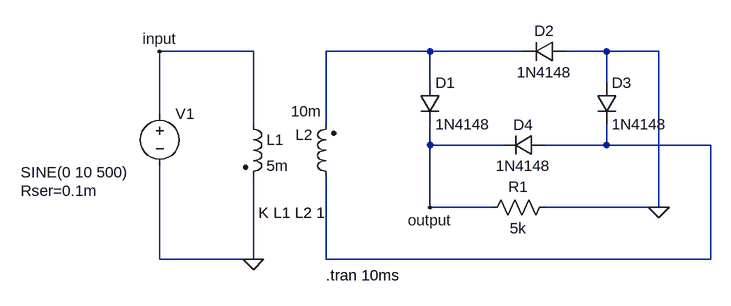
[diagram p0: schematic rectifier.asc]
rectifier.asc, the LTspice schematic file:
Version 4
SHEET 1 880 680
WIRE -64 96 -208 96
WIRE 208 96 48 96
WIRE 352 96 208 96
WIRE 480 96 416 96
WIRE 560 96 480 96
WIRE 208 144 208 96
WIRE 480 144 480 96
WIRE -208 192 -208 96
WIRE -64 208 -64 96
WIRE 48 208 48 96
WIRE 208 240 208 208
WIRE 320 240 208 240
WIRE 480 240 480 208
WIRE 480 240 384 240
WIRE 640 240 480 240
WIRE 208 336 208 240
WIRE 304 336 208 336
WIRE 560 336 560 96
WIRE 560 336 384 336
WIRE -208 416 -208 272
WIRE -64 416 -64 288
WIRE -64 416 -208 416
WIRE 48 416 48 288
WIRE 640 416 640 240
WIRE 640 416 48 416
FLAG -64 416 0
FLAG 560 336 0
FLAG 208 336 output
FLAG -208 96 input
SYMBOL voltage -208 176 R0
WINDOW 123 0 0 Left 0
WINDOW 39 -214 134 Left 2
WINDOW 3 -214 106 Left 2
SYMATTR SpiceLine Rser=0.1m
SYMATTR InstName V1
SYMATTR Value SINE(0 10 500)
SYMBOL diode 192 144 R0
SYMATTR InstName D1
SYMATTR Value 1N4148
SYMBOL diode 416 80 R90
WINDOW 0 0 32 VBottom 2
WINDOW 3 32 32 VTop 2
SYMATTR InstName D2
SYMATTR Value 1N4148
SYMBOL res 400 320 R90
WINDOW 0 0 56 VBottom 2
WINDOW 3 32 56 VTop 2
SYMATTR InstName R1
SYMATTR Value 5k
SYMBOL diode 464 144 R0
SYMATTR InstName D3
SYMATTR Value 1N4148
SYMBOL diode 384 224 R90
WINDOW 0 0 32 VBottom 2
WINDOW 3 32 32 VTop 2
SYMATTR InstName D4
SYMATTR Value 1N4148
SYMBOL ind2 -80 192 R0
SYMATTR InstName L1
SYMATTR Value 5m
SYMATTR Type ind
SYMBOL ind2 64 304 R180
WINDOW 0 36 80 Left 2
WINDOW 3 23 116 Left 2
SYMATTR InstName L2
SYMATTR Value 10m
SYMATTR Type ind
TEXT 48 440 Left 2 !.tran 10ms
TEXT -56 344 Left 2 !K L1 L2 1

The netlist it stands for:
* rectifier.asc
V1 input 0 SINE(0 10 500) Rser=0.1m
D1 N001 output 1N4148
D2 0 N001 1N4148
R1 0 output 5k
D3 0 N002 1N4148
D4 N002 output 1N4148
L1 input 0 5m
L2 N002 N001 10m
.model D D
.lib standard.dio
.tran 10ms
K L1 L2 1
.backanno
.end